# Altium schematic sheet Bluepill and Power.SchDoc
size A3; SheetNumber: 1; SheetTotal: 9
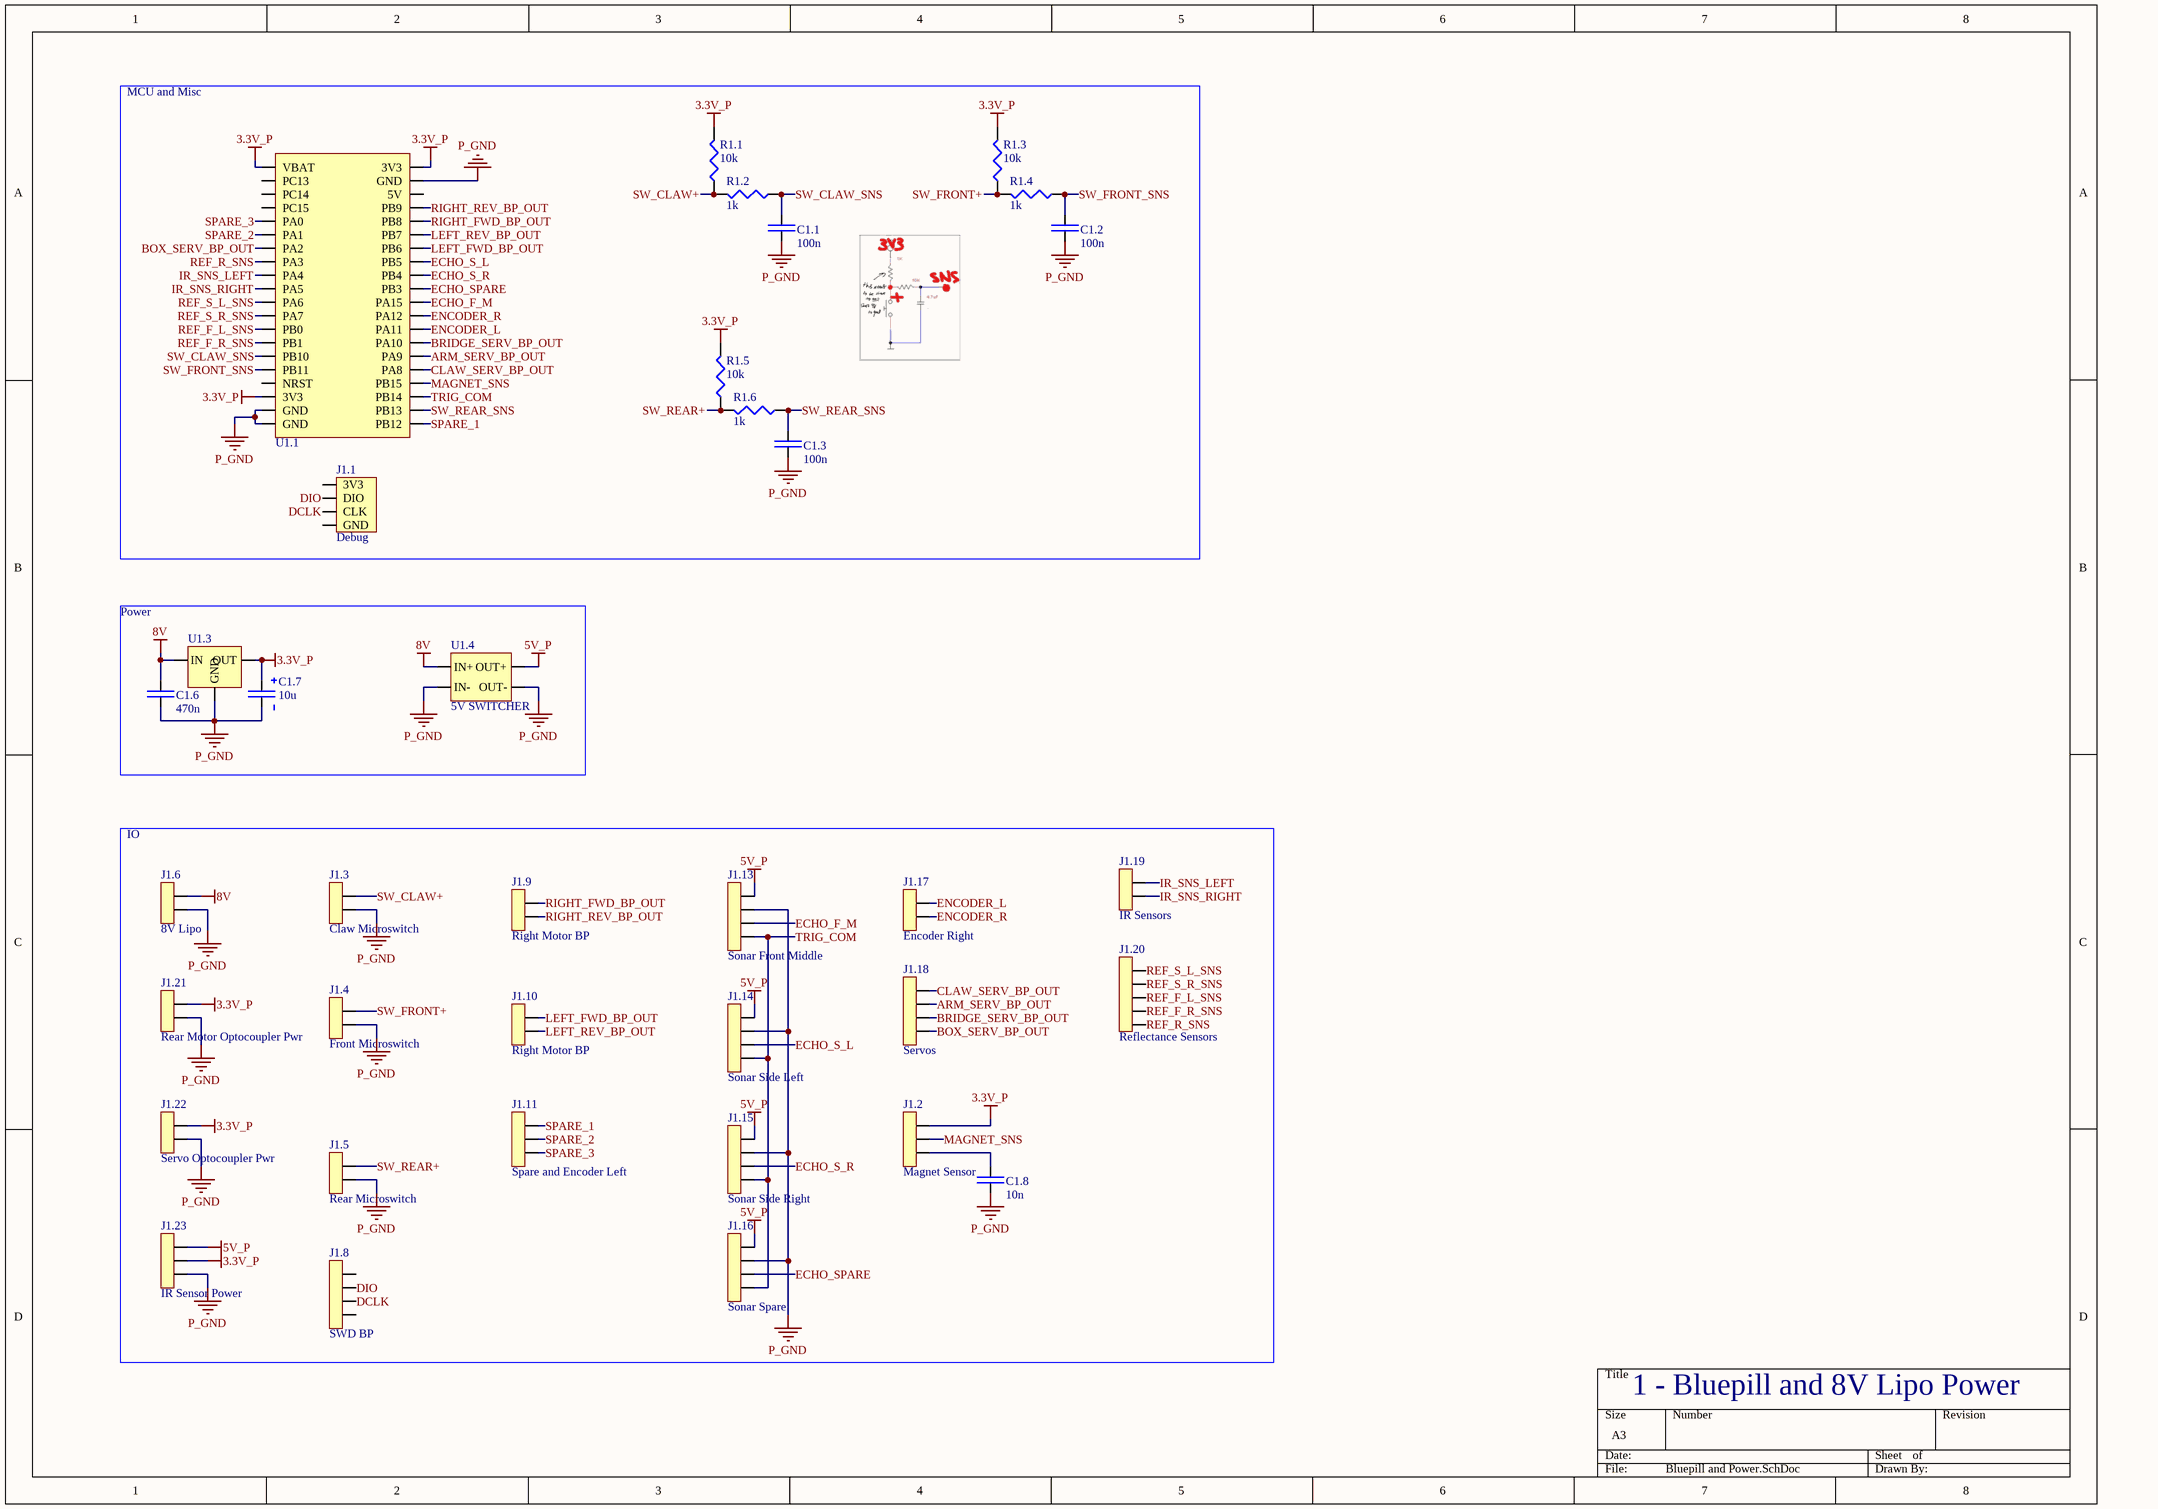
[diagram p0: Bluepill and Power.SchDoc]

## Parts
C1.1  100n  [Non Polarized Cap]
C1.2  100n  [Non Polarized Cap]
C1.3  100n  [Non Polarized Cap]
C1.6  470n  [Non Polarized Cap]
C1.7  10u  [Polarized Cap]
C1.8  10n  [Non Polarized Cap]
J1.1  Debug  [Four Pads]
J1.2  Magnet Sensor  [3pos JST]
J1.3  Claw Microswitch  [2pos JST]
J1.4  Front Microswitch  [2pos JST]
J1.5  Rear Microswitch  [2pos JST]
J1.6  8V Lipo  [2pos JST]
J1.8  SWD BP  [4Pos JST]
J1.9  Right Motor BP  [2pos JST]
J1.10  Right Motor BP  [2pos JST]
J1.11  Spare and Encoder Left  [3pos JST]
J1.13  Sonar Front Middle  [4Pos JST]
J1.14  Sonar Side Left  [4Pos JST]
J1.15  Sonar Side Right  [4Pos JST]
J1.16  Sonar Spare  [4Pos JST]
J1.17  Encoder Right  [2pos JST]
J1.18  Servos  [4Pos JST]
J1.19  IR Sensors  [2pos JST]
J1.20  Reflectance Sensors  [5POS JST]
J1.21  Rear Motor Optocoupler Pwr  [2pos JST]
J1.22  Servo Optocoupler Pwr  [2pos JST]
J1.23  IR Sensor Power  [3pos JST]
R1.1  10k  [Res_Generic]
R1.2  1k  [Res_Generic]
R1.3  10k  [Res_Generic]
R1.4  1k  [Res_Generic]
R1.5  10k  [Res_Generic]
R1.6  1k  [Res_Generic]
U1.1  Bluepill  [DIP40]  (value not drawn)
U1.3  3.3V  [TO220]  (value not drawn)
U1.4  5V SWITCHER  [ADJ Switcher]

## Blocks framed on the sheet
MCU and Misc: C1.1-C1.3 J1.1 R1.1-R1.6 U1.1
Power: C1.6 C1.7 U1.3 U1.4
IO: C1.8 J1.2-J1.6 J1.8-J1.11 J1.13-J1.23

## Nets
3.3V_P: C1.7.1 J1.2.3 J1.21.2 J1.22.2 J1.23.2 R1.1.2 R1.3.2 R1.5.2 U1.1.1(VBAT) U1.1.18(3V3) U1.1.40(3V3) U1.3.2(OUT)
5V_P: J1.13.4 J1.14.4 J1.15.4 J1.16.4 J1.23.3 U1.4.4(OUT+)
8V: C1.6.2 J1.6.2 U1.3.3(IN) U1.4.1(IN+)
P_GND: C1.1.1 C1.2.1 C1.3.1 C1.6.1 C1.7.2 C1.8.1 J1.3.1 J1.4.1 J1.5.1 J1.6.1 J1.13.3 J1.14.3 J1.15.3 J1.16.3 J1.21.1 J1.22.1 J1.23.1 U1.1.19(GND) U1.1.20(GND) U1.1.39(GND) U1.3.1(GND) U1.4.2(IN-) U1.4.3(OUT-)
ARM_SERV_BP_OUT: J1.18.3 U1.1.26(PA9)
BOX_SERV_BP_OUT: J1.18.1 U1.1.7(PA2)
BRIDGE_SERV_BP_OUT: J1.18.2 U1.1.27(PA10)
CLAW_SERV_BP_OUT: J1.18.4 U1.1.25(PA8)
DCLK: J1.1.3(CLK) J1.8.2
DIO: J1.1.2(DIO) J1.8.3
ECHO_F_M: J1.13.2 U1.1.30(PA15)
ECHO_S_L: J1.14.2 U1.1.33(PB5)
ECHO_S_R: J1.15.2 U1.1.32(PB4)
ECHO_SPARE: J1.16.2 U1.1.31(PB3)
ENCODER_L: J1.17.2 U1.1.28(PA11)
ENCODER_R: J1.17.1 U1.1.29(PA12)
IR_SNS_LEFT: J1.19.2 U1.1.9(PA4)
IR_SNS_RIGHT: J1.19.1 U1.1.10(PA5)
LEFT_FWD_BP_OUT: J1.10.2 U1.1.34(PB6)
LEFT_REV_BP_OUT: J1.10.1 U1.1.35(PB7)
MAGNET_SNS: J1.2.2 U1.1.24(PB15)
REF_F_L_SNS: J1.20.2 U1.1.13(PB0)
REF_F_R_SNS: J1.20.1 U1.1.14(PB1)
REF_R_SNS: J1.20.5 U1.1.8(PA3)
REF_S_L_SNS: J1.20.4 U1.1.11(PA6)
REF_S_R_SNS: J1.20.3 U1.1.12(PA7)
RIGHT_FWD_BP_OUT: J1.9.2 U1.1.36(PB8)
RIGHT_REV_BP_OUT: J1.9.1 U1.1.37(PB9)
SPARE_1: J1.11.3 U1.1.21(PB12)
SPARE_2: J1.11.2 U1.1.6(PA1)
SPARE_3: J1.11.1 U1.1.5(PA0)
SW_CLAW+: J1.3.2 R1.1.1 R1.2.2
SW_CLAW_SNS: C1.1.2 R1.2.1 U1.1.15(PB10)
SW_FRONT+: J1.4.2 R1.3.1 R1.4.2
SW_FRONT_SNS: C1.2.2 R1.4.1 U1.1.16(PB11)
SW_REAR+: J1.5.2 R1.5.1 R1.6.2
SW_REAR_SNS: C1.3.2 R1.6.1 U1.1.22(PB13)
TRIG_COM: J1.13.1 J1.14.1 J1.15.1 J1.16.1 U1.1.23(PB14)
NetC1.8_2: C1.8.2 J1.2.1

Not connected (* = marked no-connect by the designer): J1.1 1(3V3) 4(GND); J1.8 1 4; U1.1 2(PC13) 3(PC14) 4(PC15) 17(NRST) 38(5V)

## Notes on the sheet
- 1 - Bluepill and 8V Lipo Power

## Library data of the parts
C1.1-C1.3 C1.6 C1.8 = Cap_Generic
C1.7 = Polarized Cap
J1.1 = BP SWD Conn
J1.2 J1.11 J1.23 = 3pos Conn
J1.3-J1.6 J1.9 J1.10 J1.17 J1.19 J1.21 J1.22 = 2pos Conn: 2pos Conn JST
J1.8 J1.13-J1.16 J1.18 = 4pos Conn
J1.20 = 5pos Conn: 5pos Conn JST
R1.1-R1.6 = Res_Generic
U1.1 = Bluepill: STM32F103C8T6
U1.3 = MC33269 3.3V Reg: MC33269 IC REG LINEAR 3.3V 800MA TO220-3; Supplier 1: Mouser; Supplier Part Number 1: 595-UA78M33CKCS
U1.4 = LM2596S: Adjutable Switcher 3.5A Max